# Altium schematic sheet ILASButtonSchem.SchDoc
size A; SheetNumber: 1; SheetTotal: 1
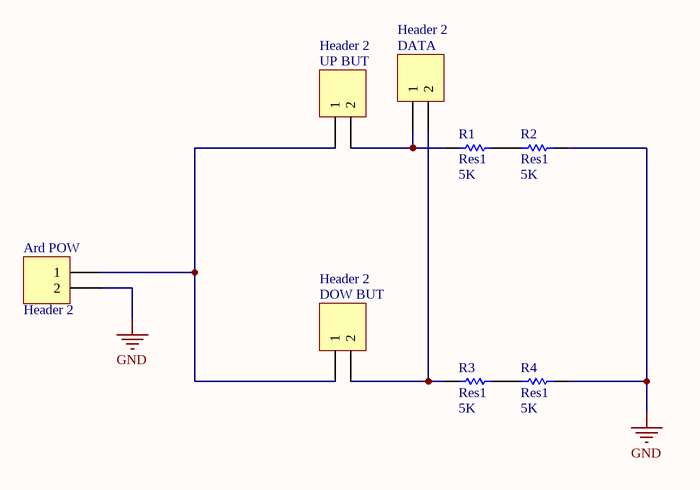
[diagram p0: ILASButtonSchem.SchDoc]

## Parts
Ard_POW  Header 2  [HDR1X2]
DATA  Header 2  [HDR1X2]
DOW_BUT  Header 2  [HDR1X2]
R1  Res1  value 5K  [AXIAL-0.3]
R2  Res1  value 5K  [AXIAL-0.3]
R3  Res1  value 5K  [AXIAL-0.3]
R4  Res1  value 5K  [AXIAL-0.3]
UP_BUT  Header 2  [HDR1X2]

## Nets
GND: Ard_POW.2 R2.2 R4.2
NetArd_POW_1: Ard_POW.1 DOW_BUT.1 UP_BUT.1
NetDATA_1: DATA.1 R1.1 UP_BUT.2
NetDATA_2: DATA.2 DOW_BUT.2 R3.1
NetR1_2: R1.2 R2.1
NetR3_2: R3.2 R4.1

## Library data of the parts
Ard_POW DATA DOW_BUT UP_BUT = Header 2: Header, 2-Pin; LatestRevisionDate: 17-Jul-2002; LatestRevisionNote: Re-released for DXP Platform.; Publisher: Altium Limited
R1-R4 = Res1: Resistor; Published: 8-Jun-2000; LatestRevisionDate: 17-Jul-2002; LatestRevisionNote: Re-released for DXP Platform.; PackageReference: AXIAL-0.3; Publisher: Altium Limited; PackageDescription: Axial Device, Thru-Hole; 2 Leads; 0.3 in Pin Spacing